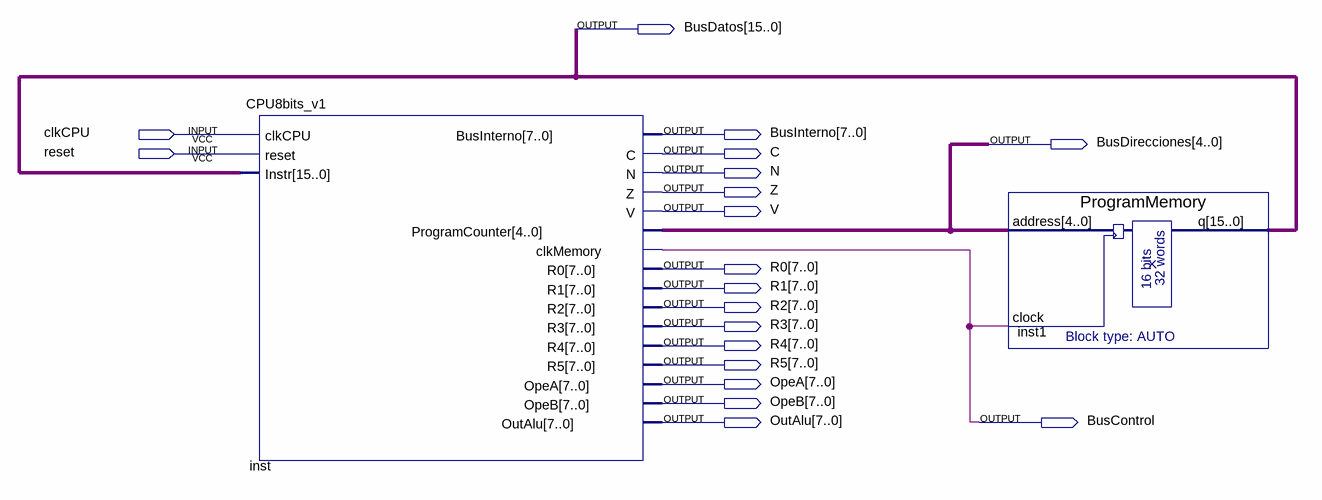
[diagram p0: schematic sheet]
// Quartus schematic CompBasicoSem5.bdf as structural Verilog: 2 symbols, 19 pins
module CompBasicoSem5 (
  input  clkCPU,
  input  reset,
  output [15:0] BusDatos,
  output [7:0] BusInterno,
  output [4:0] BusDirecciones,
  output C,
  output N,
  output Z,
  output V,
  output [7:0] R0,
  output [7:0] R1,
  output [7:0] R2,
  output [7:0] R3,
  output [7:0] R4,
  output [7:0] R5,
  output [7:0] OpeA,
  output [7:0] OpeB,
  output [7:0] OutAlu,
  output BusControl
);

  CPU8bits_v1 inst (
    .clkCPU(clkCPU), .reset(reset), .Instr(BusDatos), .BusInterno(BusInterno), .C(C), .N(N), .Z(Z), .V(V),
    .ProgramCounter(BusDirecciones), .clkMemory(BusControl), .R0(R0), .R1(R1), .R2(R2), .R3(R3), .R4(R4),
    .R5(R5), .OpeA(OpeA), .OpeB(OpeB), .OutAlu(OutAlu));
  ProgramMemory inst1 (.address(BusDirecciones), .clock(BusControl), .q(BusDatos));
endmodule
